# Altium schematic sheet POWR0011 Regulator Footprints.SchDoc: Flatsat Regulator Footprints
size A3; Engineer: A. Shaw, E.Nafis, C. Brown; DocumentNumber: POWR0011; SheetNumber: 5; SheetTotal: 6; Description: Power Regulator Footprints for Flatsat; Version: 1.0
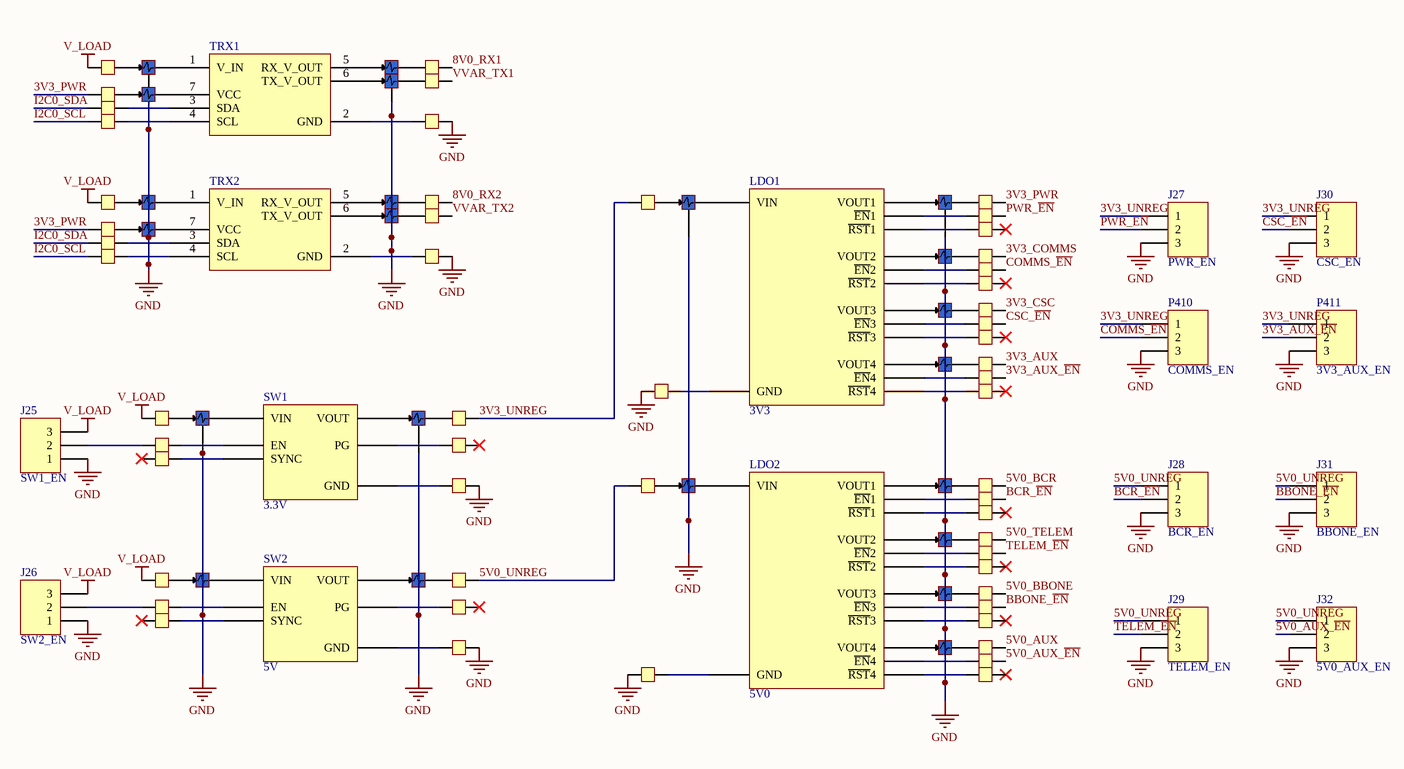
[diagram p0: POWR0011 Regulator Footprints.SchDoc]

## Parts
F106  FilterPwr  [FILTERPWR]  (value not drawn)
F107  FilterPwr  [FILTERPWR]  (value not drawn)
F108  FilterPwr  [FILTERPWR]  (value not drawn)
F109  FilterPwr  [FILTERPWR]  (value not drawn)
F110  FilterPwr  [FILTERPWR]  (value not drawn)
F111  FilterPwr  [FILTERPWR]  (value not drawn)
F112  FilterPwr  [FILTERPWR]  (value not drawn)
F113  FilterPwr  [FILTERPWR]  (value not drawn)
F114  FilterPwr  [FILTERPWR]  (value not drawn)
F115  FilterPwr  [FILTERPWR]  (value not drawn)
F116  FilterPwr  [FILTERPWR]  (value not drawn)
F117  FilterPwr  [FILTERPWR]  (value not drawn)
F118  FilterPwr  [FILTERPWR]  (value not drawn)
F119  FilterPwr  [FILTERPWR]  (value not drawn)
F120  FilterPwr  [FILTERPWR]  (value not drawn)
F121  FilterPwr  [FILTERPWR]  (value not drawn)
F122  FilterPwr  [FILTERPWR]  (value not drawn)
F123  FilterPwr  [FILTERPWR]  (value not drawn)
F124  FilterPwr  [FILTERPWR]  (value not drawn)
F125  FilterPwr  [FILTERPWR]  (value not drawn)
F126  FilterPwr  [FILTERPWR]  (value not drawn)
F127  FilterPwr  [FILTERPWR]  (value not drawn)
J25  SW1_EN  [HDR1X3]
J26  SW2_EN  [HDR1X3]
J27  PWR_EN  [HDR1X3]
J28  BCR_EN  [HDR1X3]
J29  TELEM_EN  [HDR1X3]
J30  CSC_EN  [HDR1X3]
J31  BBONE_EN  [HDR1X3]
J32  5V0_AUX_EN  [HDR1X3]
LDO1  3V3  [LDO]
LDO2  5V0  [LDO]
P356  Jumper  [Jumper]  (value not drawn)
P357  Jumper  [Jumper]  (value not drawn)
P358  Jumper  [Jumper]  (value not drawn)
P359  Jumper  [Jumper]  (value not drawn)
P360  Jumper  [Jumper]  (value not drawn)
P361  Jumper  [Jumper]  (value not drawn)
P362  Jumper  [Jumper]  (value not drawn)
P363  Jumper  [Jumper]  (value not drawn)
P364  Jumper3  [JUMPER4]  (value not drawn)
P365  Jumper  [Jumper]  (value not drawn)
P366  Jumper  [Jumper]  (value not drawn)
P367  Jumper3  [JUMPER4]  (value not drawn)
P368  Jumper  [Jumper]  (value not drawn)
P369  Jumper  [Jumper]  (value not drawn)
P370  Jumper  [Jumper]  (value not drawn)
P371  Jumper  [Jumper]  (value not drawn)
P372  Jumper  [Jumper]  (value not drawn)
P373  Jumper  [Jumper]  (value not drawn)
P374  Jumper  [Jumper]  (value not drawn)
P375  Jumper  [Jumper]  (value not drawn)
P376  Jumper3  [JUMPER4]  (value not drawn)
P377  Jumper  [Jumper]  (value not drawn)
P378  Jumper3  [JUMPER4]  (value not drawn)
P379  Jumper3  [JUMPER4]  (value not drawn)
P380  Jumper  [Jumper]  (value not drawn)
P381  Jumper3  [JUMPER4]  (value not drawn)
P382  Jumper  [Jumper]  (value not drawn)
P383  Jumper  [Jumper]  (value not drawn)
P384  Jumper  [Jumper]  (value not drawn)
P385  Jumper  [Jumper]  (value not drawn)
P386  Jumper  [Jumper]  (value not drawn)
P387  Jumper  [Jumper]  (value not drawn)
P388  Jumper  [Jumper]  (value not drawn)
P389  Jumper  [Jumper]  (value not drawn)
P390  Jumper  [Jumper]  (value not drawn)
P391  Jumper  [Jumper]  (value not drawn)
P392  Jumper  [Jumper]  (value not drawn)
P393  Jumper  [Jumper]  (value not drawn)
P394  Jumper  [Jumper]  (value not drawn)
P395  Jumper  [Jumper]  (value not drawn)
P396  Jumper  [Jumper]  (value not drawn)
P397  Jumper  [Jumper]  (value not drawn)
P398  Jumper  [Jumper]  (value not drawn)
P399  Jumper  [Jumper]  (value not drawn)
P400  Jumper  [Jumper]  (value not drawn)
P401  Jumper  [Jumper]  (value not drawn)
P402  Jumper  [Jumper]  (value not drawn)
P403  Jumper  [Jumper]  (value not drawn)
P404  Jumper  [Jumper]  (value not drawn)
P405  Jumper  [Jumper]  (value not drawn)
P406  Jumper  [Jumper]  (value not drawn)
P407  Jumper  [Jumper]  (value not drawn)
P408  Jumper  [Jumper]  (value not drawn)
P409  Jumper  [Jumper]  (value not drawn)
P410  COMMS_EN  [HDR1X3]
P411  3V3_AUX_EN  [HDR1X3]
SW1  3.3V  [LVSwitcher]
SW2  5V  [LVSwitcher]
TRX1  TRX_REGULATOR  [TRX_REGULATOR]  (value not drawn)
TRX2  TRX_REGULATOR  [TRX_REGULATOR]  (value not drawn)

## Nets
GND: F106.3 F107.3 F108.3 F109.3 F110.3 F111.3 F112.3 F113.3 F114.3 F115.3 F116.3 F117.3 F118.3 F119.3 F120.3 F121.3 F122.3 F123.3 F124.3 F125.3 F126.3 F127.3 J25.1 J26.1 J27.3 J28.3 J29.3 J30.3 J31.3 J32.3 P372.2 P375.2 P378.2 P381.2 P384.1 P385.1 P410.3 P411.3
V_LOAD: J25.3 J26.3 P356.1 P360.1 P364.1 P367.1
3V3_AUX: P395.2
3V3_AUX_~{EN}: P396.2 P411.2
3V3_COMMS: P389.2
3V3_CSC: P392.2
3V3_PWR: P357.2 P361.2 P386.2
3V3_UNREG: J27.1 J30.1 P376.2 P382.1 P410.1 P411.1
5V0_AUX: P407.2
5V0_AUX_~{EN}: J32.2 P408.2
5V0_BBONE: P404.2
5V0_BCR: P398.2
5V0_TELEM: P401.2
5V0_UNREG: J28.1 J29.1 J31.1 J32.1 P379.2 P383.1
8V0_RX1: P370.2
8V0_RX2: P373.2
BBONE_~{EN}: J31.2 P405.2
BCR_~{EN}: J28.2 P399.2
COMMS_~{EN}: P390.2 P410.2
CSC_~{EN}: J30.2 P393.2
I2C0_SCL: P359.1 P363.1
I2C0_SDA: P358.1 P362.1
PWR_~{EN}: J27.2 P387.2
TELEM_~{EN}: J29.2 P402.2
VVAR_TX1: P371.2
VVAR_TX2: P374.2
NetF106_1: F106.1 P356.2
NetF106_2: F106.2 TRX1.1(V_IN)
NetF107_1: F107.1 P357.1
NetF107_2: F107.2 TRX1.7(VCC)
NetF108_1: F108.1 P360.2
NetF108_2: F108.2 TRX2.1(V_IN)
NetF109_1: F109.1 P361.1
NetF109_2: F109.2 TRX2.7(VCC)
NetF110_1: F110.1 P364.2
NetF110_2: F110.2 SW1.Vin(VIN)
NetF111_1: F111.1 P367.2
NetF111_2: F111.2 SW2.Vin(VIN)
NetF112_1: F112.1 TRX1.5(RX_V_OUT)
NetF112_2: F112.2 P370.1
NetF113_1: F113.1 TRX1.6(TX_V_OUT)
NetF113_2: F113.2 P371.1
NetF114_1: F114.1 TRX2.5(RX_V_OUT)
NetF114_2: F114.2 P373.1
NetF115_1: F115.1 TRX2.6(TX_V_OUT)
NetF115_2: F115.2 P374.1
NetF116_1: F116.1 SW1.Vout(VOUT)
NetF116_2: F116.2 P376.1
NetF117_1: F117.1 SW2.Vout(VOUT)
NetF117_2: F117.2 P379.1
NetF118_1: F118.1 P382.2
NetF118_2: F118.2 LDO1.VIN
NetF119_1: F119.1 P383.2
NetF119_2: F119.2 LDO2.VIN
NetF120_1: F120.1 LDO1.VOUT1
NetF120_2: F120.2 P386.1
NetF121_1: F121.1 LDO1.VOUT2
NetF121_2: F121.2 P389.1
NetF122_1: F122.1 LDO1.VOUT3
NetF122_2: F122.2 P392.1
NetF123_1: F123.1 LDO1.VOUT4
NetF123_2: F123.2 P395.1
NetF124_1: F124.1 LDO2.VOUT1
NetF124_2: F124.2 P398.1
NetF125_1: F125.1 LDO2.VOUT2
NetF125_2: F125.2 P401.1
NetF126_1: F126.1 LDO2.VOUT3
NetF126_2: F126.2 P404.1
NetF127_1: F127.1 LDO2.VOUT4
NetF127_2: F127.2 P407.1
NetJ25_2: J25.2 P365.1
NetJ26_2: J26.2 P368.1
NetLDO1_EN1: LDO1.EN1(~{EN}1) P387.1
NetLDO1_EN2: LDO1.EN2(~{EN}2) P390.1
NetLDO1_EN3: LDO1.EN3(~{EN}3) P393.1
NetLDO1_EN4: LDO1.EN4(~{EN}4) P396.1
NetLDO1_GND: LDO1.GND P385.2
NetLDO1_RST1: LDO1.RST1(~{RST}1) P388.1
NetLDO1_RST2: LDO1.RST2(~{RST}2) P391.1
NetLDO1_RST3: LDO1.RST3(~{RST}3) P394.1
NetLDO1_RST4: LDO1.RST4(~{RST}4) P397.1
NetLDO2_EN1: LDO2.EN1(~{EN}1) P399.1
NetLDO2_EN2: LDO2.EN2(~{EN}2) P402.1
NetLDO2_EN3: LDO2.EN3(~{EN}3) P405.1
NetLDO2_EN4: LDO2.EN4(~{EN}4) P408.1
NetLDO2_GND: LDO2.GND P384.2
NetLDO2_RST1: LDO2.RST1(~{RST}1) P400.1
NetLDO2_RST2: LDO2.RST2(~{RST}2) P403.1
NetLDO2_RST3: LDO2.RST3(~{RST}3) P406.1
NetLDO2_RST4: LDO2.RST4(~{RST}4) P409.1
NetP358_2: P358.2 TRX1.3(SDA)
NetP359_2: P359.2 TRX1.4(SCL)
NetP362_2: P362.2 TRX2.3(SDA)
NetP363_2: P363.2 TRX2.4(SCL)
NetP365_2: P365.2 SW1.EN
NetP366_2: P366.2 SW1.SYNC
NetP368_2: P368.2 SW2.EN
NetP369_2: P369.2 SW2.SYNC
NetP372_1: P372.1 TRX1.2(GND)
NetP375_1: P375.1 TRX2.2(GND)
NetP377_1: P377.1 SW1.PG
NetP378_1: P378.1 SW1.GND
NetP380_1: P380.1 SW2.PG
NetP381_1: P381.1 SW2.GND

Not connected (* = marked no-connect by the designer): P366 1*; P369 1*; P377 2*; P380 2*; P388 2*; P391 2*; P394 2*; P397 2*; P400 2*; P403 2*; P406 2*; P409 2*

## Notes on the sheet
- Title
- Description:
- Size:
- Author:
- Date:
- A3
- Time:
- Version
- Sheet:
- Drawing No.:
- of
- File:

## Library data of the parts
J25-J32 P410 P411 = Header 3: Header, 3-Pin; LatestRevisionDate: 17-Jul-2002; LatestRevisionNote: Re-released for DXP Platform.; Publisher: Altium Limited
LDO1 LDO2 = LDO
SW1 SW2 = LVSWITCHER